# Altium schematic sheet Master_Power.SchDoc
size A4; Organization: Altium Limited; Address1: L3, 12a Rodborough Rd; Address2: Frenchs Forest; Address3: NSW; Address4: Australia 2086
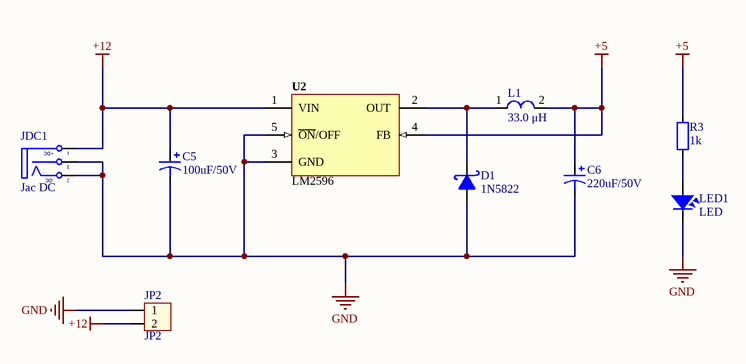
[diagram p0: Master_Power.SchDoc]

## Parts
C5  100uF/50V  [C8mm]
C6  220uF/50V  [C8mm]
D1  1N5822  [SMA]
JDC1  Jac DC  [DC-IN]
JP2  JP2  [CON2]
L1  33.0 μH  [L-SMD-M-7.3x4.5]
LED1  LED  [LED-0805-Red]
R3  1k  [RES-SMD-0805]
U2  LM2596  [TO263-5]

## Nets
+5: C6.1 L1.2 R3.2 U2.4(FB)
+12: C5.1 JDC1.1(T) JP2.2 U2.1(VIN)
GND: C5.2 C6.2 D1.1(A) JDC1.2(TN) JDC1.3(S) JP2.1 LED1.2 U2.3(GND) U2.5(~{ON}/OFF)
NetD1_2: D1.2(K) L1.1 U2.2(OUT)
NetLED1_1: LED1.1 R3.1

## Notes on the sheet
- Labels drawn without touching a wire or pin: Page Contents:, Project:
- Size:
- Date:
- A4
- Ver:
- Time:
- Author:
- Checked by:
- File:
- (in symbol DCIN) +DC; -DC

## Library data of the parts
C5 C6 = Cap Pol: Polarized Capacitor (Axial); Published: 8-Jun-2000; LatestRevisionDate: 17-Jul-2002; LatestRevisionNote: Re-released for DXP Platform.; PackageReference: POLAR0.8; Publisher: Altium Limited
D1 = 1N5822: Schottky Rectifiers; Value: Diode c?m 1N5408
JDC1 = DCIN: Jac DC input; Value: Jac DC
JP2 = Con2: Connector 2; Value: Connector 2
L1 = L-SMD-1: partNo: 78477010; Manufacturer: Wurth Elektronik; Inductance: 33.0 μH; ComponentLink1Description: Manufacturer; ComponentLink1URL: http://www.we-online.de; Created by: Baojun Chen; Created Date: Nov.2015; ComponentLink2Description: Datasheet; ComponentLink2URL: http://katalog.we-online.de/pbs/datasheet/78477010.pdf
LED1 = LED: LED Single colour Green and Red; Value: LED 3 ly Single Colour
R3 = Resistor - SMD: Resistor; Manufacturer: Generic Components; Class: Passive; Published: 08/06/2000; Publisher: Altium Hobart Technology Centre
U2 = LM2596: Max Input Voltage: 12 V; Max Output Current: 3 (6.0 peak) A; Max Output Voltage: mV; Category: IC-Power; Min Input Voltage: mV; Min Output Voltage: mV; Mounting Technology: Surface Mount; Status: Unreleased; Supply Voltage: mV; Temperature Range: -40 to +125 degC